# Altium schematic sheet Flash.SchDoc
size A
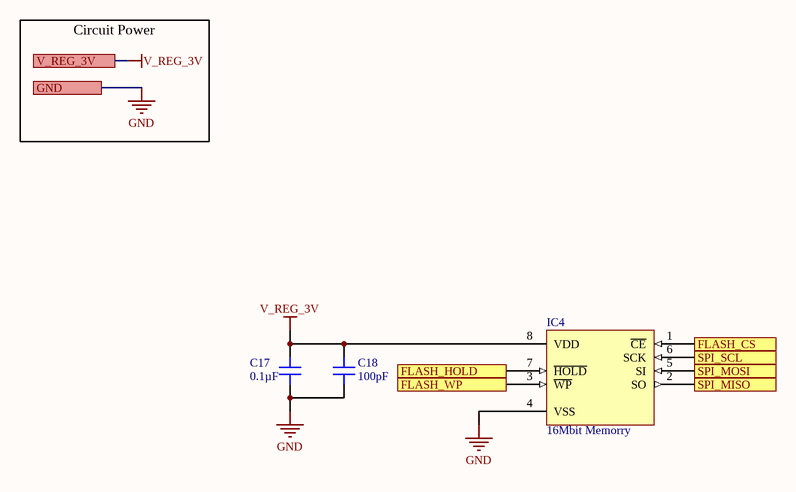
[diagram p0: Flash.SchDoc]

## Parts
C17  0.1µF  [CAP 0402_1005]
C18  100pF  [CAP 0402_1005]
IC4  16Mbit Memorry  [MICROCHIP SOIC-8 150mil Wide]

## Ports
FLASH_CS (in), FLASH_HOLD (out), FLASH_WP (in), GND, SPI_MISO (out), SPI_MOSI (in), SPI_SCL (in), V_REG_3V

## Nets
GND: C17.1 C18.1 IC4.4(VSS) ; port GND
V_REG_3V: C17.2 C18.2 IC4.8(VDD) ; port V_REG_3V
FLASH_CS: IC4.1(~{CE}) ; port FLASH_CS
FLASH_HOLD: IC4.7(~{HOLD}) ; port FLASH_HOLD
FLASH_WP: IC4.3(~{WP}) ; port FLASH_WP
SPI_MISO: IC4.2(SO) ; port SPI_MISO
SPI_MOSI: IC4.5(SI) ; port SPI_MOSI
SPI_SCL: IC4.6(SCK) ; port SPI_SCL

## Notes on the sheet
- Circuit Power

## Library data of the parts
C17 = CAP00001: CAP CER 0.1UF 16V X7R 0402; Manufacturer: KEMET; Manufacturer P/N: C0402C104K4RAC7411; Tolerance: ±10%; Device ID: CAP00001; Mounting Type: Surface Mount; Part Type: Capacitor; VALUE: 0.1µF; Operating Temperature: -55°C ~ 125°C; Voltage: 16V; Package: 0402 (1005 Metric); Supplier1: Digi-Key; Supplier1 P/N: 399-C0402C104K4RAC7411CT-ND; Supplier2: Mouser; Supplier2 P/N: 80-C0402C104K4R7411; Temperature Coefficient: X7R
C18 = CAP00000: CAP CER 100PF 16V C0G/NP0 0402; Manufacturer: KEMET; Manufacturer P/N: C0402C101K4GACTU; Tolerance: ±10%; Temperature Coefficient: C0G, NP0; Device ID: CAP00000; Mounting Type: Surface Mount; Part Type: Capacitor; VALUE: 100pF; Operating Temperature: -55°C ~ 125°C; Voltage: 16V; Package: 0402 (1005 Metric); Supplier1: Digi-Key; Supplier1 P/N: 399-7749-1-ND; Supplier2: Mouser; Supplier2 P/N: 80-C0402C101K4G
IC4 = MEM00000: IC FLASH 4MBIT SPI 40MHZ 8SOIC; Manufacturer: Microchip Technology; Manufacturer P/N: SST25PF040CT-40E/SN; VALUE: 4Mbit Memory; Memory Type: Non-Volatile; Memory Size: 4Mb (512K x 8); Write Cycle Time - Word, Page: 5ms; Voltage - Supply: 2.3V ~ 3.6V; Device ID: MEM00000; Part Type: IC; Operating Temperature: -40°C ~ 125°C (TA); Package: 8-SOIC; Mounting Type: Surface Mount; Memory Format: FLASH; Technology: FLASH; Memory Interface: SPI; Clock Frequency: 40MHz; Supplier1: Digi-Key; Supplier1 P/N: SST25PF040CT-40E/SNCT-ND; Supplier2: Mouser; Supplier2 P/N: 579-T25PF040CT-40ESN